# Altium schematic sheet Connectors.SchDoc
size Letter
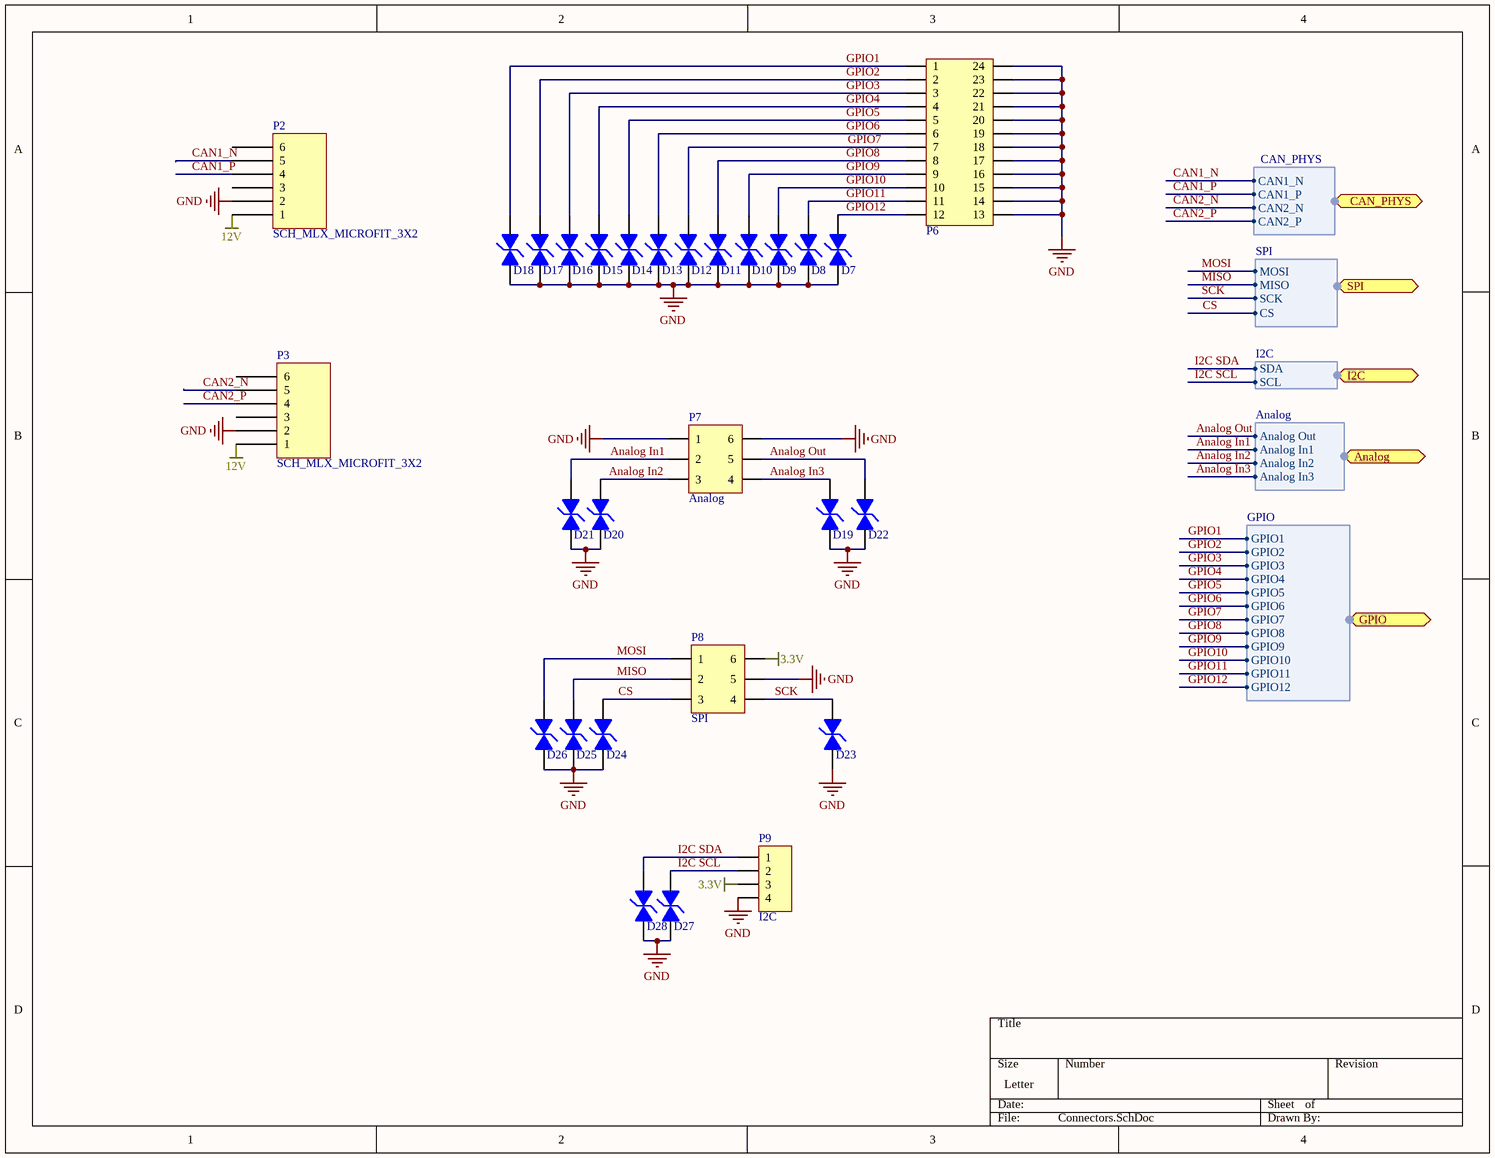
[diagram p0: Connectors.SchDoc]

## Parts
D7  TVS Diode  [TVS Diode]  (value not drawn)
D8  TVS Diode  [TVS Diode]  (value not drawn)
D9  TVS Diode  [TVS Diode]  (value not drawn)
D10  TVS Diode  [TVS Diode]  (value not drawn)
D11  TVS Diode  [TVS Diode]  (value not drawn)
D12  TVS Diode  [TVS Diode]  (value not drawn)
D13  TVS Diode  [TVS Diode]  (value not drawn)
D14  TVS Diode  [TVS Diode]  (value not drawn)
D15  TVS Diode  [TVS Diode]  (value not drawn)
D16  TVS Diode  [TVS Diode]  (value not drawn)
D17  TVS Diode  [TVS Diode]  (value not drawn)
D18  TVS Diode  [TVS Diode]  (value not drawn)
D19  TVS Diode  [TVS Diode]  (value not drawn)
D20  TVS Diode  [TVS Diode]  (value not drawn)
D21  TVS Diode  [TVS Diode]  (value not drawn)
D22  TVS Diode  [TVS Diode]  (value not drawn)
D23  TVS Diode  [TVS Diode]  (value not drawn)
D24  TVS Diode  [TVS Diode]  (value not drawn)
D25  TVS Diode  [TVS Diode]  (value not drawn)
D26  TVS Diode  [TVS Diode]  (value not drawn)
D27  TVS Diode  [TVS Diode]  (value not drawn)
D28  TVS Diode  [TVS Diode]  (value not drawn)
P2  SCH_MLX_MICROFIT_3X2  [PCB_MLX_MICROFIT_3X2]
P3  SCH_MLX_MICROFIT_3X2  [PCB_MLX_MICROFIT_3X2]
P6  24-Pin Vertical Header  [24-Pin Vertical Header]  (value not drawn)
P7  Analog  [6-Pin Vertical Header]
P8  SPI  [6-Pin Vertical Header]
P9  I2C  [4-Pin Vertical Header]

## Ports
Analog (harness Analog), CAN_PHYS (harness CAN_PHYS), GPIO (harness GPIO), I2C (harness I2C), SPI (harness SPI)

## Harnesses
CAN_PHYS: CAN1_N, CAN1_P, CAN2_N, CAN2_P
I2C: SDA, SCL
Analog: Analog Out, Analog In1, Analog In2, Analog In3
GPIO: GPIO1, GPIO2, GPIO3, GPIO4, GPIO5, GPIO6, GPIO7, GPIO8, GPIO9, GPIO10, GPIO11, GPIO12
SPI: MOSI, MISO, SCK, CS

## Nets
3.3V: P8.6 P9.3
12V: P2.1 P3.1
GND: D7.2 D8.2 D9.2 D10.2 D11.2 D12.2 D13.2 D14.2 D15.2 D16.2 D17.2 D18.2 D19.2 D20.2 D21.2 D22.2 D23.2 D24.2 D25.2 D26.2 D27.2 D28.2 P2.2 P3.2 P6.13 P6.14 P6.15 P6.16 P6.17 P6.18 P6.19 P6.20 P6.21 P6.22 P6.23 P6.24 P7.1 P7.6 P8.5 P9.4
Analog In1: D21.1 P7.2 ; port Analog.Analog In1
Analog In2: D20.1 P7.3 ; port Analog.Analog In2
Analog In3: D19.1 P7.4 ; port Analog.Analog In3
Analog Out: D22.1 P7.5 ; port Analog.Analog Out
CAN1_N: P2.5 ; port CAN_PHYS.CAN1_N
CAN1_P: P2.4 ; port CAN_PHYS.CAN1_P
CAN2_N: P3.5 ; port CAN_PHYS.CAN2_N
CAN2_P: P3.4 ; port CAN_PHYS.CAN2_P
CS: D24.1 P8.3 ; port SPI.CS
GPIO1: D18.1 P6.1 ; port GPIO.GPIO1
GPIO2: D17.1 P6.2 ; port GPIO.GPIO2
GPIO3: D16.1 P6.3 ; port GPIO.GPIO3
GPIO4: D15.1 P6.4 ; port GPIO.GPIO4
GPIO5: D14.1 P6.5 ; port GPIO.GPIO5
GPIO6: D13.1 P6.6 ; port GPIO.GPIO6
GPIO7: D12.1 P6.7 ; port GPIO.GPIO7
GPIO8: D11.1 P6.8 ; port GPIO.GPIO8
GPIO9: D10.1 P6.9 ; port GPIO.GPIO9
GPIO10: D9.1 P6.10 ; port GPIO.GPIO10
GPIO11: D8.1 P6.11 ; port GPIO.GPIO11
GPIO12: D7.1 P6.12 ; port GPIO.GPIO12
I2C SCL: D27.1 P9.2 ; port I2C.SCL
I2C SDA: D28.1 P9.1 ; port I2C.SDA
MISO: D25.1 P8.2 ; port SPI.MISO
MOSI: D26.1 P8.1 ; port SPI.MOSI
SCK: D23.1 P8.4 ; port SPI.SCK

Not connected (* = marked no-connect by the designer): P2 3 6; P3 3 6

## Library data of the parts
D7-D28 = TVS Diode: Manufacturer: Bourns; Manufacturer ID: CDSOD323-T03SC
P6 = 24-Pin Vertical Header: Manufacturer: Sullins; Manufacturer No.: PPPC132LFBN-RC
P7 P8 = 6-Pin Vertical Header: Manufacturer: Sullins; Manufacturer ID: PPPC032LFBN-RC
P9 = 4-Pin Vertical Header: Manufacturer: Sullins; Manufacturer No.: PPPC041LFBN-RC